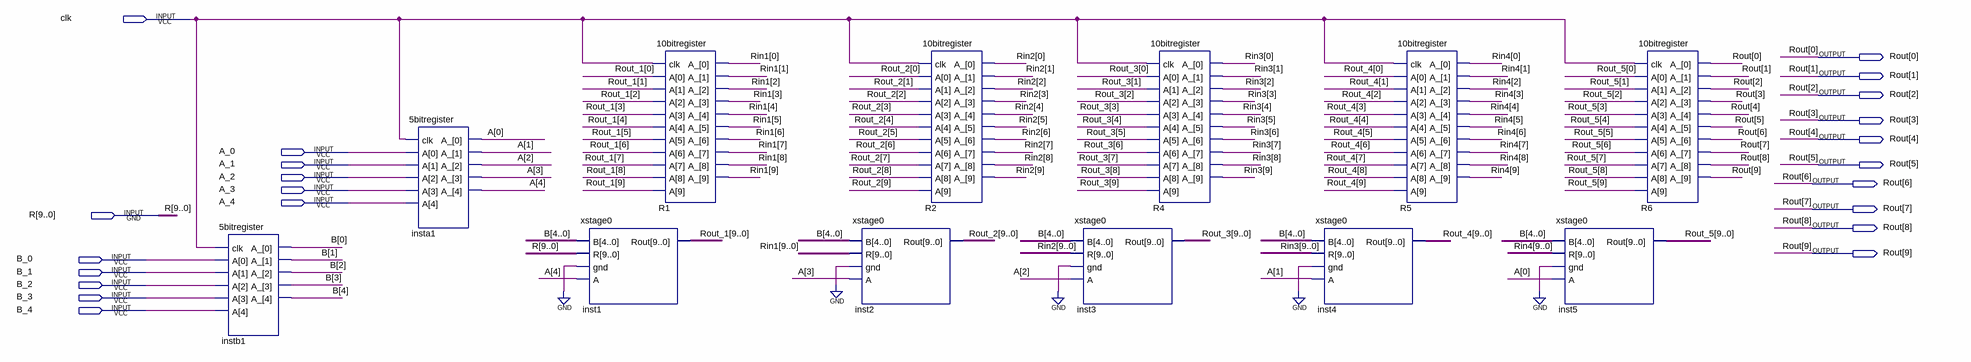
[diagram p0: schematic sheet]
// Quartus schematic mult_pipe_huge.bdf as structural Verilog: 12 symbols, 22 pins
module mult_pipe_huge (
  input  clk,
  input  A_0,
  input  A_1,
  input  A_2,
  input  A_3,
  input  A_4,
  input  [9:0] R,
  input  B_0,
  input  B_1,
  input  B_2,
  input  B_3,
  input  B_4,
  output [9:0] Rout
);

  wire [4:0] A, B;
  wire [9:0] Rin1, Rin2, Rin3, Rin4, Rout_1, Rout_2, Rout_3, Rout_4, Rout_5;

  \5bitregister  instb1 (.clk(clk), .A({B_4, B_3, B_2, B_1, B_0}), .A_(B));
  \5bitregister  insta1 (.clk(clk), .A({A_4, A_3, A_2, A_1, A_0}), .A_(A));
  xstage0 inst1 (.B(B), .R(R), .gnd(1'b0), .A(A[4]), .Rout(Rout_1));
  \10bitregister  R1 (.clk(clk), .A(Rout_1), .A_(Rin1));
  xstage0 inst2 (.B(B), .R(Rin1), .gnd(1'b0), .A(A[3]), .Rout(Rout_2));
  \10bitregister  R2 (.clk(clk), .A(Rout_2), .A_(Rin2));
  xstage0 inst3 (.B(B), .R(Rin2), .gnd(1'b0), .A(A[2]), .Rout(Rout_3));
  \10bitregister  R4 (.clk(clk), .A(Rout_3), .A_(Rin3));
  xstage0 inst4 (.B(B), .R(Rin3), .gnd(1'b0), .A(A[1]), .Rout(Rout_4));
  \10bitregister  R5 (.clk(clk), .A(Rout_4), .A_(Rin4));
  xstage0 inst5 (.B(B), .R(Rin4), .gnd(1'b0), .A(A[0]), .Rout(Rout_5));
  \10bitregister  R6 (.clk(clk), .A(Rout_5), .A_(Rout));
endmodule
